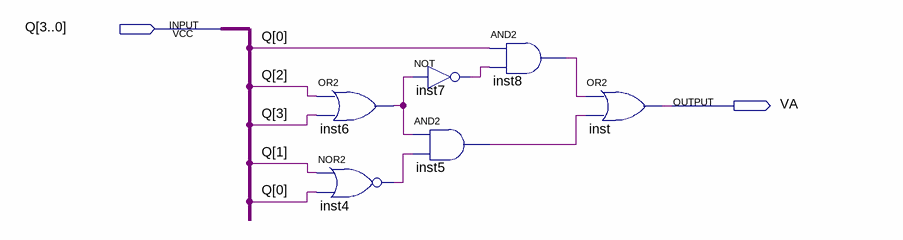
[diagram p0: schematic sheet]
// Quartus schematic VerdeAbajo.bdf as structural Verilog: 6 symbols, 2 pins
module VerdeAbajo (
  input  [3:0] Q,
  output VA
);

  wire inst4_out, inst5_out, inst6_out, inst7_out, inst8_out;

  or inst6 (inst6_out, Q[2], Q[3]);
  nor inst4 (inst4_out, Q[1], Q[0]);
  not inst7 (inst7_out, inst6_out);
  and inst5 (inst5_out, inst6_out, inst4_out);
  and inst8 (inst8_out, Q[0], inst7_out);
  or inst (VA, inst8_out, inst5_out);
endmodule
